# EAGLE design untitled (EAGLE 7.2.0)
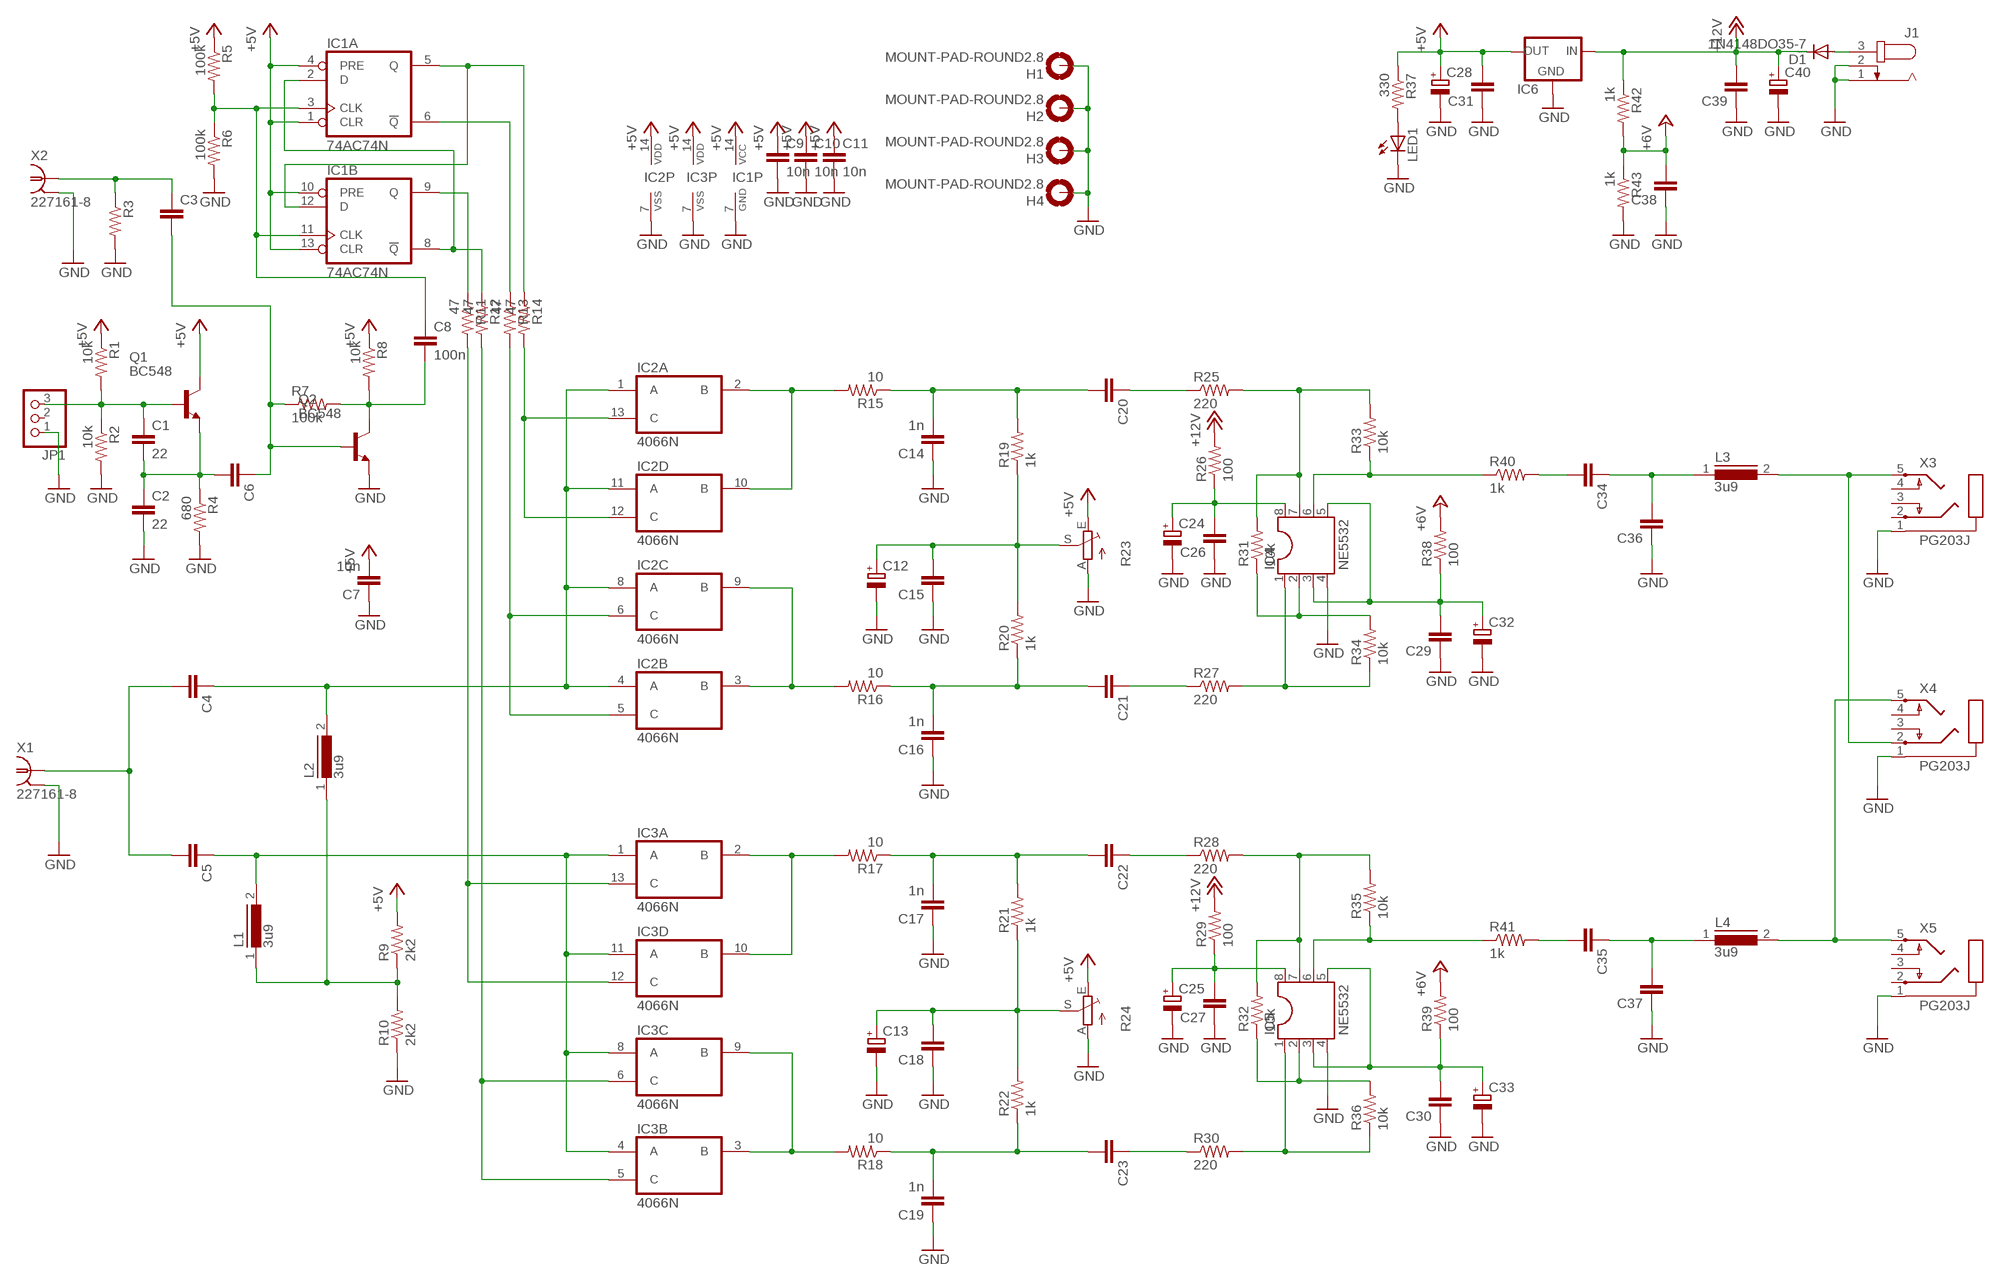
[diagram p0: schematic, sheet 1]

## Parts
C1  22  C-EU025-025X050  [C025-025X050]
C2  22  C-EU025-025X050  [C025-025X050]
C3  C-EU050-025X075  [C050-025X075]
C4  C-EU050-025X075  [C050-025X075]
C5  C-EU050-025X075  [C050-025X075]
C6  C-EU050-025X075  [C050-025X075]
C7  10n  C-EU050-025X075  [C050-025X075]
C8  100n  C-EU075-032X103  [C075-032X103]
C9  10n  C-EU050-025X075  [C050-025X075]
C10  10n  C-EU050-025X075  [C050-025X075]
C11  10n  C-EU050-025X075  [C050-025X075]
C12  CPOL-EUE5-6  [E5-6]
C13  CPOL-EUE5-6  [E5-6]
C14  1n  C-EU050-025X075  [C050-025X075]
C15  C-EU050-025X075  [C050-025X075]
C16  1n  C-EU050-025X075  [C050-025X075]
C17  1n  C-EU050-025X075  [C050-025X075]
C18  C-EU050-025X075  [C050-025X075]
C19  1n  C-EU050-025X075  [C050-025X075]
C20  C-EU050-025X075  [C050-025X075]
C21  C-EU050-025X075  [C050-025X075]
C22  C-EU050-025X075  [C050-025X075]
C23  C-EU050-025X075  [C050-025X075]
C24  CPOL-EUE5-6  [E5-6]
C25  CPOL-EUE5-6  [E5-6]
C26  C-EU050-025X075  [C050-025X075]
C27  C-EU050-025X075  [C050-025X075]
C28  CPOL-EUE5-6  [E5-6]
C29  C-EU050-025X075  [C050-025X075]
C30  C-EU050-025X075  [C050-025X075]
C31  C-EU050-025X075  [C050-025X075]
C32  CPOL-EUE5-6  [E5-6]
C33  CPOL-EUE5-6  [E5-6]
C34  C-EU050-025X075  [C050-025X075]
C35  C-EU050-025X075  [C050-025X075]
C36  C-EU050-025X075  [C050-025X075]
C37  C-EU050-025X075  [C050-025X075]
C38  C-EU050-025X075  [C050-025X075]
C39  C-EU050-025X075  [C050-025X075]
C40  CPOL-EUE5-6  [E5-6]
D1  1N4148DO35-7  [DO35-7]
H1  MOUNT-PAD-ROUND2.8  [2,8-PAD]
H2  MOUNT-PAD-ROUND2.8  [2,8-PAD]
H3  MOUNT-PAD-ROUND2.8  [2,8-PAD]
H4  MOUNT-PAD-ROUND2.8  [2,8-PAD]
IC1  74AC74N  [DIL14]
IC2  4066N  [DIL14]
IC3  4066N  [DIL14]
IC4  NE5532  DIL8  [DIL08]
IC5  NE5532  DIL8  [DIL08]
IC6  78XXS  [78XXS]
J1  JACK-PLUG0  [SPC4077]
JP1  PINHD-1X3  [1X03]
L1  3u9  MMICC7  [MMICC7]
L2  3u9  MMICC7  [MMICC7]
L3  3u9  MMICC7  [MMICC7]
L4  3u9  MMICC7  [MMICC7]
LED1  LED3MM  [LED3MM]
Q1  BC548  [TO92-EBC]
Q2  BC548  [TO92-EBC]
R1  10k  R-US_0207/7  [0207/7]
R2  10k  R-US_0207/7  [0207/7]
R3  R-US_0207/7  [0207/7]
R4  680  R-US_0207/7  [0207/7]
R5  100k  R-US_0207/7  [0207/7]
R6  100k  R-US_0207/7  [0207/7]
R7  100k  R-US_0207/7  [0207/7]
R8  10k  R-US_0207/7  [0207/7]
R9  2k2  R-US_0207/7  [0207/7]
R10  2k2  R-US_0207/7  [0207/7]
R11  47  R-US_0207/7  [0207/7]
R12  47  R-US_0207/7  [0207/7]
R13  47  R-US_0207/7  [0207/7]
R14  47  R-US_0207/7  [0207/7]
R15  10  R-US_0207/7  [0207/7]
R16  10  R-US_0207/7  [0207/7]
R17  10  R-US_0207/7  [0207/7]
R18  10  R-US_0207/7  [0207/7]
R19  1k  R-US_0207/7  [0207/7]
R20  1k  R-US_0207/7  [0207/7]
R21  1k  R-US_0207/7  [0207/7]
R22  1k  R-US_0207/7  [0207/7]
R23  TRIM_EU-B64Y  [B64Y]
R24  TRIM_EU-B64Y  [B64Y]
R25  220  R-US_0207/7  [0207/7]
R26  100  R-US_0207/7  [0207/7]
R27  220  R-US_0207/7  [0207/7]
R28  220  R-US_0207/7  [0207/7]
R29  100  R-US_0207/7  [0207/7]
R30  220  R-US_0207/7  [0207/7]
R31  10k  R-US_0207/7  [0207/7]
R32  10k  R-US_0207/7  [0207/7]
R33  10k  R-US_0207/7  [0207/7]
R34  10k  R-US_0207/7  [0207/7]
R35  10k  R-US_0207/7  [0207/7]
R36  10k  R-US_0207/7  [0207/7]
R37  330  R-US_0207/7  [0207/7]
R38  100  R-US_0207/7  [0207/7]
R39  100  R-US_0207/7  [0207/7]
R40  1k  R-US_0207/7  [0207/7]
R41  1k  R-US_0207/7  [0207/7]
R42  1k  R-US_0207/7  [0207/7]
R43  1k  R-US_0207/7  [0207/7]
X1  227161-8  [AMP_227161]
X2  227161-8  [AMP_227161]
X3  PG203J  [PG203J]
X4  PG203J  [PG203J]
X5  PG203J  [PG203J]

## Nets
+5V: C7.2 C9.1 C10.1 C11.1 C28.+ C31.2 IC1.1(A:CLR) IC1.4(A:PRE) IC1.10(B:PRE) IC1.13(B:CLR) IC1.14(P:VCC) IC2.14(P:VDD) IC3.14(P:VDD) IC6.OUT Q1.C R1.1 R5.1 R8.1 R9.2 R23.E R24.E R37.1
+12V: C39.2 C40.+ D1.C IC6.IN R26.2 R29.2 R42.1
+24V: C38.2 R38.2 R39.2 R42.2 R43.1 ; supply symbol labelled +6V
GND: C2.2 C7.1 C9.2 C10.2 C11.2 C12.- C13.- C14.1 C15.1 C16.1 C17.1 C18.1 C19.1 C24.- C25.- C26.1 C27.1 C28.- C29.1 C30.1 C31.1 C32.- C33.- C36.1 C37.1 C38.1 C39.1 C40.- H1.B2,8(MOUNT) H2.B2,8(MOUNT) H3.B2,8(MOUNT) H4.B2,8(MOUNT) IC1.7(P:GND) IC2.7(P:VSS) IC3.7(P:VSS) IC4.4 IC5.4 IC6.GND J1.1 J1.2 JP1.1 LED1.K(C) Q2.E R2.2 R3.2 R4.2 R6.2 R10.1 R23.A R24.A R43.2 X1.2 X2.2 X3.1 X4.1 X5.1
N$1: L1.1 L2.1 R9.1 R10.2
N$2: C4.2 C5.2 X1.1
N$3: C4.1 IC2.1(A:A) IC2.4(B:A) IC2.8(C:A) IC2.11(D:A) L2.2
N$4: C5.1 IC3.1(A:A) IC3.4(B:A) IC3.8(C:A) IC3.11(D:A) L1.2
N$5: IC2.3(B:B) IC2.9(C:B) R16.2
N$6: IC2.2(A:B) IC2.10(D:B) R15.2
N$7: IC3.2(A:B) IC3.10(D:B) R17.2
N$8: IC3.3(B:B) IC3.9(C:B) R18.2
N$9: IC2.12(D:C) IC2.13(A:C) R14.2
N$10: IC2.5(B:C) IC2.6(C:C) R13.2
N$11: IC3.12(D:C) IC3.13(A:C) R11.2
N$12: IC3.5(B:C) IC3.6(C:C) R12.2
N$13: C14.2 C20.2 R15.1 R19.2
N$14: C16.2 C21.2 R16.1 R20.1
N$15: C17.2 C22.2 R17.1 R21.2
N$16: C19.2 C23.2 R18.1 R22.1
N$17: IC1.2(A:D) IC1.8(B:!Q) R12.1
N$18: IC1.6(A:!Q) R13.1
N$19: IC1.5(A:Q) IC1.12(B:D) R14.1
N$20: IC1.9(B:Q) R11.1
N$21: C8.1 IC1.3(A:CLK) IC1.11(B:CLK) R5.2 R6.1
N$22: IC4.1 R27.2 R34.1
N$23: C21.1 R27.1
N$24: C20.1 R25.1
N$25: IC4.7 R25.2 R31.2 R33.2
N$26: IC4.2 R31.1 R34.2
N$27: IC4.6 R33.1 R40.1
N$28: C24.+ C26.2 IC4.8 R26.1
N$29: C29.2 C32.+ IC4.3 IC4.5 R38.1
N$30: C34.2 R40.2
N$31: C34.1 C36.2 L3.1
N$32: C12.+ C15.2 R19.1 R20.2 R23.S
N$35: D1.A J1.3
N$36: C3.1 R3.1 X2.1
N$37: IC5.1 R30.2 R36.1
N$38: C23.1 R30.1
N$39: C22.1 R28.1
N$40: IC5.7 R28.2 R32.2 R35.2
N$41: IC5.2 R32.1 R36.2
N$42: IC5.6 R35.1 R41.1
N$43: C25.+ C27.2 IC5.8 R29.1
N$44: C35.2 R41.2
N$45: C30.2 C33.+ IC5.3 IC5.5 R39.1
N$46: C35.1 C37.2 L4.1
N$47: C13.+ C18.2 R21.1 R22.2 R24.S
N$54: C1.1 JP1.3 Q1.B R1.2 R2.1
N$55: C1.2 C2.1 C6.2 Q1.E R4.1
N$56: L3.2 X3.5 X4.2
N$57: C8.2 Q2.C R7.2 R8.2
N$58: C3.2 C6.1 Q2.B R7.1
N$59: LED1.A R37.2
N$60: L4.2 X4.5 X5.5
Unconnected: JP1.2 X3.2 X3.3 X3.4 X4.3 X4.4 X5.2 X5.3 X5.4

## Library data of the parts
C1-C11 C14-C23 C26 C27 C29-C31 C34-C39 = rcl:C-EU: CAPACITOR, European symbol
C12 C13 C24 C25 C28 C32 C33 C40 = rcl:CPOL-EU: POLARIZED CAPACITOR, European symbol
D1 = diode:1N4148: DIODE high speed (Philips)
H1-H4 = holes:MOUNT-PAD-ROUND: MOUNTING PAD, round
IC1 = 74xx-eu:74*74: Dual D type positive edge triggered FLIP FLOP, preset and clear
IC2 IC3 = 40xx:4066: Quad bilateral ANALOG SWITCH
IC4 IC5 = ic-package:DIL8: Dual In Line / Socket
IC6 = v-reg:78XXS: VOLTAGE REGULATOR
J1 = con-jack:JACK-PLUG: DC POWER JACK Power Jack, DC, Right Angle, Through Hole, Rated 5A at 16VDC, PC Terminals Distributor: Farnell (www.Farnell.de) Drawing: 84N1161.pdf / 84N1162.pdf Manufacturer: SPC Technology (www.spctechnology.com) Type: SPC4077 / SPC 4078; OC_FARNELL: unknown; OC_NEWARK: unknown
JP1 = pinhead:PINHD-1X3: PIN HEADER
L1-L4 = inductors:MMICC7: INDUCTOR
LED1 = led:LED: LED OSRAM: - CHIPLED LG R971, LG N971, LY N971, LG Q971, LY Q971, LO R971, LY R971 LH N974, LH R974 LS Q976, LO Q976, LY Q976 LO Q996 - Hyper CHIPLED LW Q18S LB Q993, LB Q99A, LB R99A - SideLED LS A670, LO A670, LY A670, LG A670, LP A670 LB A673, LV A673, LT A673, LW A673 LH A674 LY A675 LS A676, LA A676, LO A676, LY A676, LW A676 LS A679, LY A679, LG A679 - Hyper Micro SIDELED® LS Y876, LA Y876, LO Y876, LY Y876 LT Y87S - SmartLED LW L88C, LW L88S LB L89C, LB L89S, LG L890 LS L89K, LO L89K, LY L89K LS L896, LA L896, LO L896, LY L896 - TOPLED LS T670, LO T670, LY T670, LG T670, LP T670 LSG T670, LSP T670, LSY T670, LOP T670, LYG T670 LG T671, LOG T671, LSG T671 LB T673, LV T673, LT T673, LW T673 LH T674 LS T676, LA T676, LO T676, LY T676, LB T676, LH T676, LSB T676, LW T676 LB T67C, LV T67C, LT T67C, LS T67K, LO T67K, LY T67K, LW E67C LS E67B, LA E67B, LO E67B, LY E67B, LB E67C, LV E67C, LT E67C LW T67C LS T679, LY T679, LG T679 LS T770, LO T770, LY T770, LG T770, LP T770 LB T773, LV T773, LT T773, LW T773 LH T774 LS E675, LA E675, LY E675, LS T675 LS T776, LA T776, LO T776, LY T776, LB T776 LHGB T686 LT T68C, LB T68C - Hyper Mini TOPLED® LB M676 - Mini TOPLED Santana® LG M470 LS M47K, LO M47K, LY M47K Source: http://www.osram.convergy.de LUXEON: - LUMILED® LXK2-PW12-R00, LXK2-PW12-S00, LXK2-PW14-U00, LXK2-PW14-V00 LXK2-PM12-R00, LXK2-PM12-S00, LXK2-PM14-U00 LXK2-PE12-Q00, LXK2-PE12-R00, LXK2-PE12-S00, LXK2-PE14-T00, LXK2-PE14-U00 LXK2-PB12-K00, LXK2-PB12-L00, LXK2-PB12-M00, LXK2-PB14-N00, LXK2-PB14-P00, LXK2-PB14-Q00 LXK2-PR12-L00, LXK2-PR12-M00, LXK2-PR14-Q00, LXK2-PR14-R00 LXK2-PD12-Q00, LXK2-PD12-R00, LXK2-PD12-S00 LXK2-PH12-R00, LXK2-PH12-S00 LXK2-PL12-P00, LXK2-PL12-Q00, LXK2-PL12-R00 Source: www.luxeon.com KINGBRIGHT: KA-3528ASYC Source: www.kingbright.com
Q1 Q2 = transistor-npn:BC548*: NPN Transistor
R1-R22 R25-R43 = rcl:R-US_: RESISTOR, American symbol
R23 R24 = pot:TRIM_EU-: POTENTIOMETER
X1 X2 = con-coax:?227161*: JACK, RIGHT ANGLE, 50 OHM, PCB, BNC Source: amp_227161.pdf; OC_FARNELL: unknown; OC_NEWARK: unknown
X3-X5 = con-hirschmann:PG203J: MIC/HEADPHONE JACK KS-S stereo microphone/headphone jack PG203JN (Schukat); OC_FARNELL: unknown; OC_NEWARK: unknown

## Board
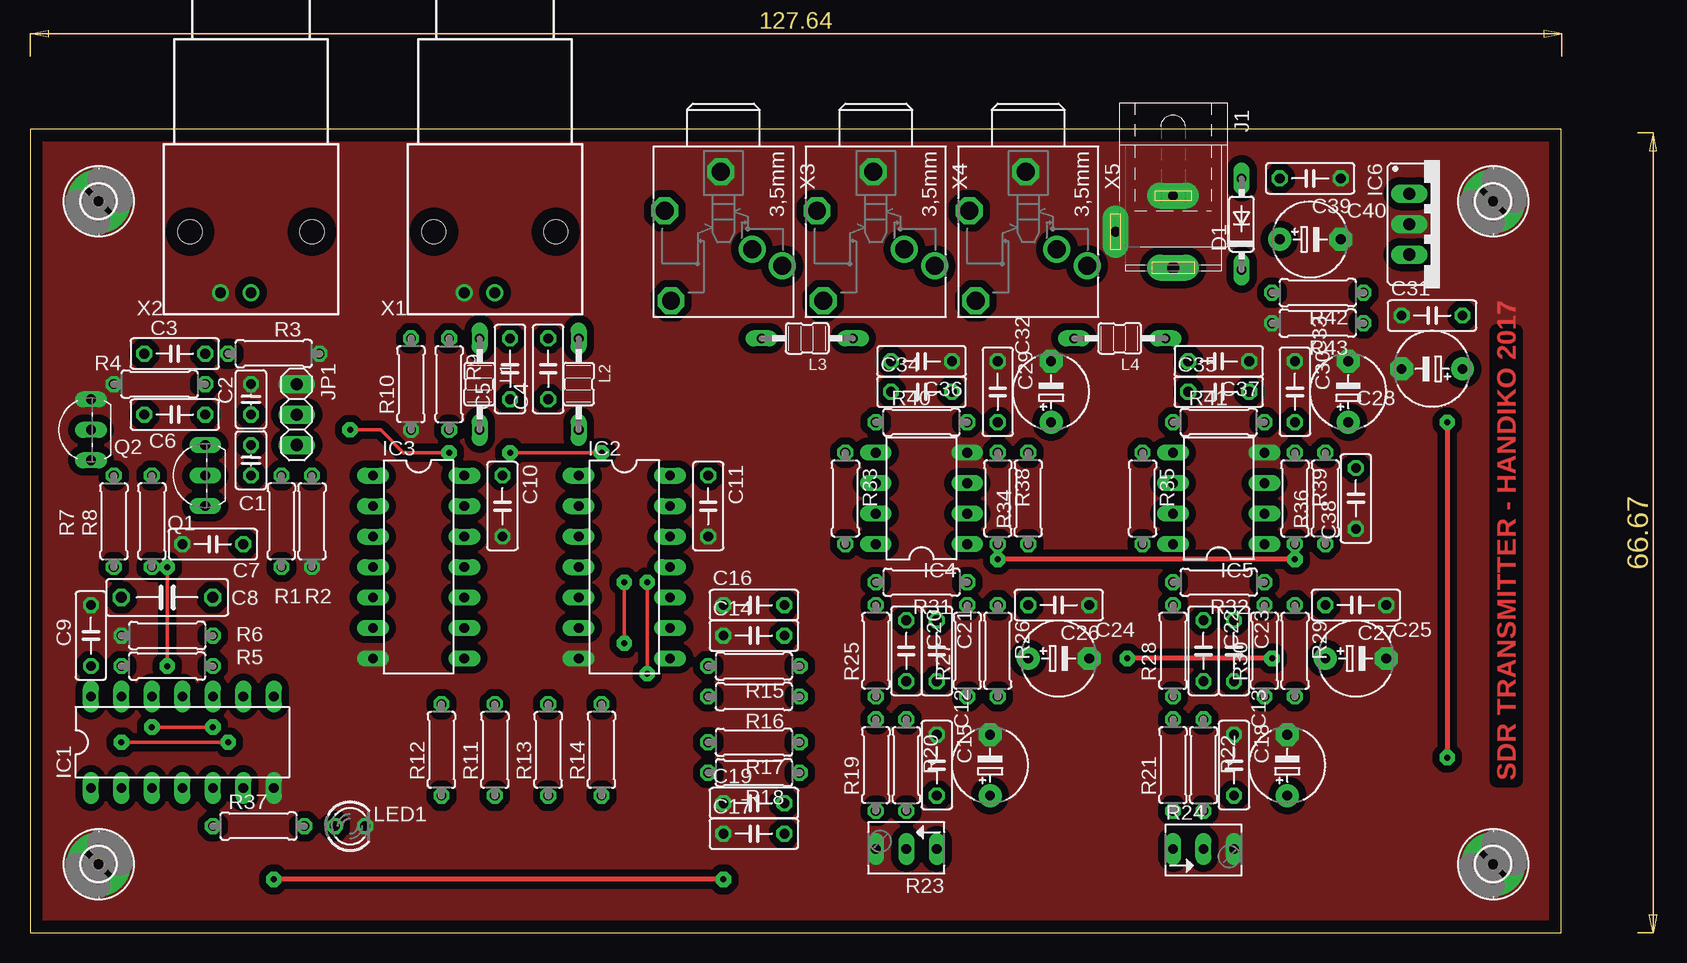
[diagram p1: board, top side]
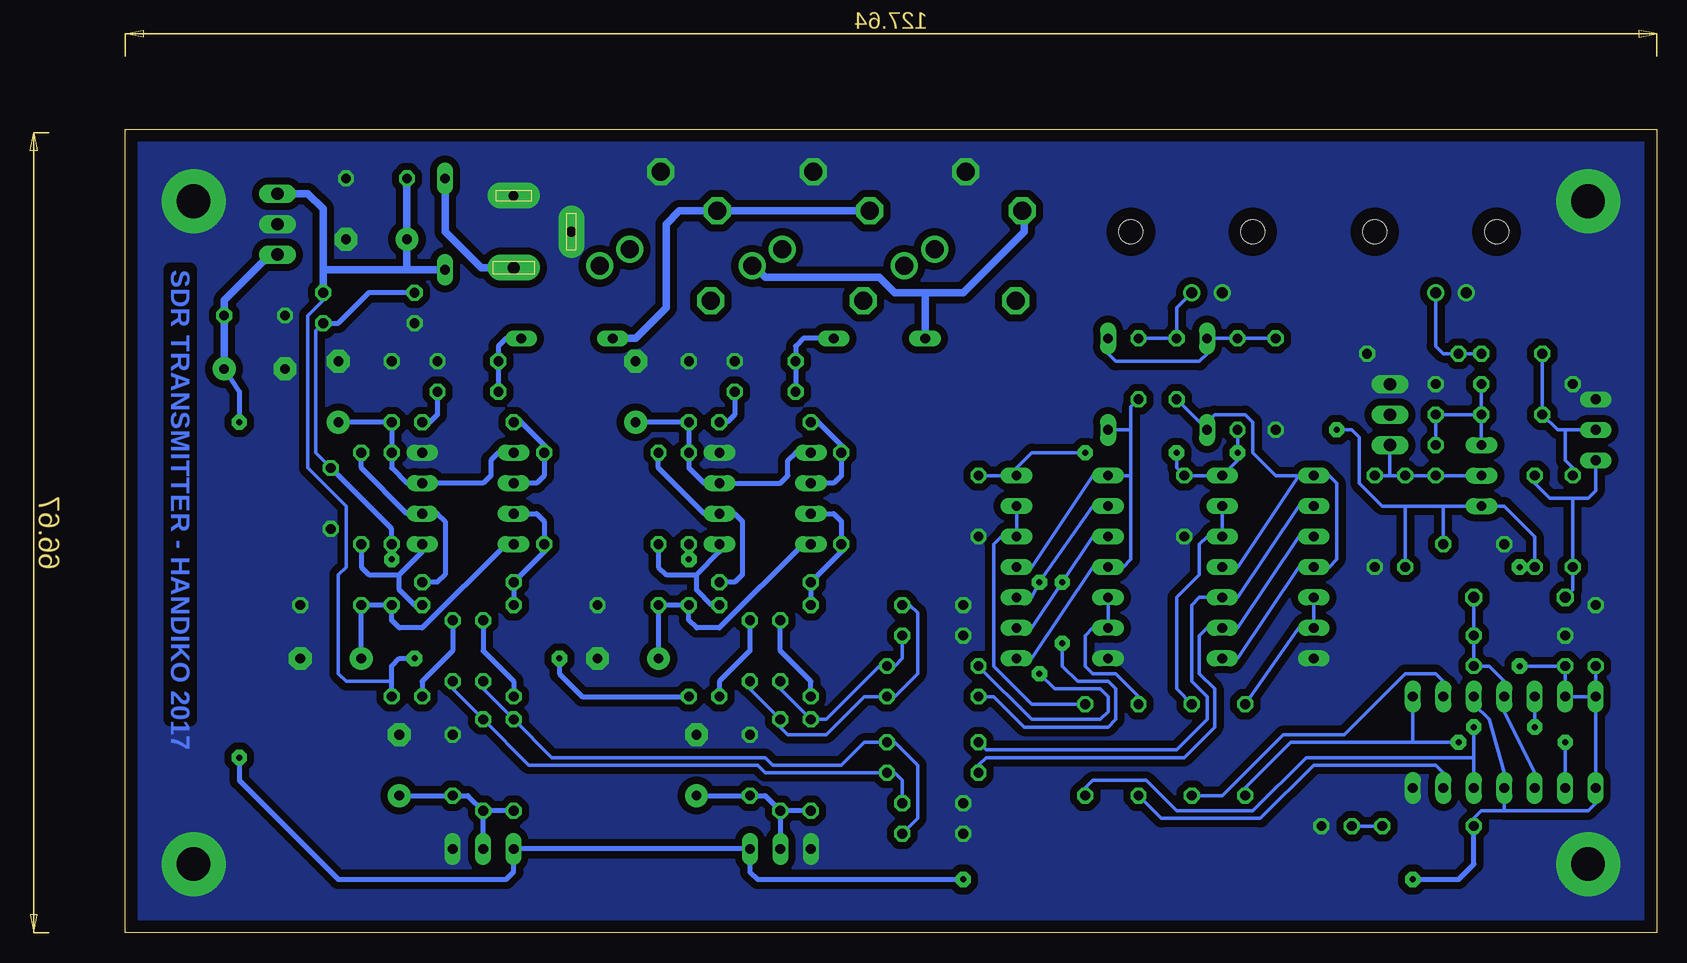
[diagram p2: board, bottom side, seen from below]

Size 127.61 x 66.98 mm. Coordinates in mm from the lower left corner, seen from the top.
Outline: 0,0 127.61,0 127.61,66.98 0,66.98 0,0
Copper layers (1*16): Top 0.035mm / dielectric 1.5mm / Bottom 0.035mm
Design rules "default": minimum track width 10mil, minimum drill 24mil, track to track 8mil, track to pad 8mil, pad to pad 8mil, via to via 8mil, smd to smd 8mil, copper to edge 40mil, drill to drill 8mil, minimum pad ring 10mil, minimum via ring 8mil, stop-mask expansion 4mil, vias tented up to drill 0mil, thermal gap 10mil

### Footprints (pad centres in the part's own frame; a part is rotated, then mirrored left to right if it is on the bottom)
C025-025X050 = drill 0.813 octagon: 1 -1.27,0; 2 1.27,0
C050-025X075 = drill 0.813 octagon: 1 -2.54,0; 2 2.54,0
C075-032X103 = drill 0.914 octagon: 1 -3.81,0; 2 3.81,0
E5-6 = drill 0.813 pad 1.905: + -2.54,0 | drill 0.813 pad 1.905 octagon: - 2.54,0
DO35-7 = drill 0.813 long: A 3.81,0; C -3.81,0
2,8-PAD = drill 2.8 pad 5.334: B2,8 0,0
DIL14 = drill 0.813 long: 1 -7.62,-3.81; 2 -5.08,-3.81; 3 -2.54,-3.81; 4 0,-3.81; 5 2.54,-3.81; 6 5.08,-3.81; 7 7.62,-3.81; 8 7.62,3.81; 9 5.08,3.81; 10 2.54,3.81; 11 0,3.81; 12 -2.54,3.81; 13 -5.08,3.81; 14 -7.62,3.81
DIL08 = drill 0.813 long: 1 -3.81,-3.81; 2 -1.27,-3.81; 3 1.27,-3.81; 4 3.81,-3.81; 5 3.81,3.81; 6 1.27,3.81; 7 -1.27,3.81; 8 -3.81,3.81
78XXS = drill 1.016 long: GND 0,-2.54; IN -2.54,-2.54; OUT 2.54,-2.54
SPC4077 = drill 0.8 pad 2.184 long: 1 -3,0; 2 0,-4.8 | drill 1 pad 2.184 long: 3 3,0
1X03 = drill 1.016 long: 1 -2.54,0; 2 0,0; 3 2.54,0
MMICC7 = drill 0.813 long: 1 -3.81,0; 2 3.81,0
LED3MM = drill 0.813 octagon: A -1.27,0; K 1.27,0
TO92-EBC = drill 0.813 long: B 0,-1.27; C -2.54,-1.27; E 2.54,-1.27
0207/7 = drill 0.813 octagon: 1 -3.81,0; 2 3.81,0
B64Y = drill 0.813 long: A 2.54,0; E -2.54,0; S 0,0
AMP_227161 = drill 0.9 pad 1.27: 1 0,-5.08; 2 -2.54,-5.08 | hole 2: -5.08,0; 5.08,0
PG203J = drill 1.499 octagon: 1 -5.004,-0.203; 4 5.74,-4.369; 5 -1.753,-4.902 | drill 1.499: 2 2.845,4.902; 3 1.448,2.388

### Placement (x,y rotation side)
C1  18.41,39.37 90 top
C2  18.41,44.45 90 top
C3  12.06,48.26 180 top
C4  43.18,46.99 90 top
C5  40.01,46.99 90 top
C6  12.06,43.18 0 top
C7  15.24,32.38 0 top
C8  11.43,27.94 180 top
C9  5.08,24.77 90 top
C10  39.37,35.56 270 top
C11  56.52,35.56 270 top
C12  80.01,13.97 90 top
C13  104.78,13.97 90 top
C14  60.33,24.77 0 top
C15  75.56,13.97 270 top
C16  60.33,27.3 0 top
C17  60.33,8.26 0 top
C18  100.33,13.97 270 top
C19  60.33,10.79 0 top
C20  73.03,23.5 270 top
C21  75.56,23.5 270 top
C22  97.79,23.5 270 top
C23  100.33,23.5 270 top
C24  85.72,22.86 0 top
C25  110.49,22.86 0 top
C26  85.72,27.3 180 top
C27  110.49,27.3 180 top
C28  116.84,46.99 180 top
C29  80.64,45.09 270 top
C30  105.41,45.09 270 top
C31  116.84,51.44 0 top
C32  85.09,45.09 90 top
C33  109.86,45.09 90 top
C34  74.3,45.09 0 top
C35  99.06,45.09 0 top
C36  74.3,47.62 180 top
C37  99.06,47.62 180 top
C38  110.49,36.2 90 top
C39  106.68,62.87 180 top
C40  106.68,57.78 0 top
D1  100.97,59.05 90 top
H1  5.71,60.96 0 top
H2  5.71,5.71 0 top
H3  121.92,5.71 0 top
H4  121.92,60.96 0 top
IC1  12.7,15.88 0 top
IC2  49.53,30.48 270 top
IC3  32.38,30.48 270 top
IC4  74.3,36.2 90 top
IC5  99.06,36.2 90 top
IC6  117.47,59.05 270 top
J1  95.25,58.42 270 top
JP1  22.23,43.18 270 top
L1  37.47,45.72 270 top
L2  45.72,45.72 270 top
L3  64.77,49.53 180 top
L4  90.81,49.53 180 top
LED1  26.67,8.89 0 top
Q1  13.34,38.1 90 top
Q2  3.81,41.91 90 top
R1  20.95,34.29 90 top
R2  23.5,34.29 270 top
R3  20.32,48.26 0 top
R4  10.79,45.72 180 top
R5  11.43,22.23 0 top
R6  11.43,24.77 180 top
R7  6.99,34.29 270 top
R8  10.16,34.29 90 top
R9  34.92,45.72 270 top
R10  31.75,45.72 90 top
R11  38.73,15.24 90 top
R12  34.29,15.24 90 top
R13  43.18,15.24 90 top
R14  47.62,15.24 90 top
R15  60.33,22.23 180 top
R16  60.33,19.68 180 top
R17  60.33,15.88 180 top
R18  60.33,13.34 180 top
R19  70.48,13.97 90 top
R20  73.03,13.97 270 top
R21  95.25,13.97 90 top
R22  97.79,13.97 270 top
R23  73.03,6.99 180 top
R24  97.79,6.99 0 top
R25  70.48,23.5 90 top
R26  80.64,23.5 270 top
R27  78.11,23.5 90 top
R28  95.25,23.5 90 top
R29  105.41,23.5 270 top
R30  102.87,23.5 90 top
R31  74.3,29.21 180 top
R32  99.06,29.21 180 top
R33  67.94,36.2 270 top
R34  83.19,36.2 90 top
R35  92.71,36.2 270 top
R36  107.95,36.2 90 top
R37  19.05,8.89 0 top
R38  80.64,36.2 270 top
R39  105.41,36.2 270 top
R40  74.3,42.55 0 top
R41  99.06,42.55 0 top
R42  107.31,53.34 180 top
R43  107.31,50.8 180 top
X1  38.73,58.42 0 top
X2  18.41,58.42 0 top
X3  57.78,58.42 270 top
X4  70.48,58.42 270 top
X5  83.19,58.42 270 top

### Tracks (layer width: path | path; a pad name or v marks a point on that pad's centre or on a via)
+5V  (via drill 0.5 pad 1.27)
  Top 0.305: v11.43,22.23 v11.43,30.48 | v47.62,40.01 v40.01,40.01 | v26.67,41.91 29.21,41.91 31.11,40.01 v34.92,40.01
  Top 0.406: v118.11,42.55 v118.11,14.61 | v57.78,4.45 v20.32,4.45
  Bottom 0.305: 17.78,35.56 Q1.C 12.7,35.56 10.16,33.02 R8.1 v11.43,30.48 | 17.78,35.56 20.95,35.56 | 20.95,35.56 R1.1 | C7.2 17.78,35.56 | C9.1 IC1.14 | IC1.14 IC1.13 R5.1 v11.43,22.23 | IC1.14 IC1.1 5.08,10.79 5.71,10.16 12.7,10.16 | IC1.10 15.24,19.05 13.97,17.78 12.7,13.34 IC1.4 12.7,10.16 | R9.2 v34.92,40.01 34.92,39.37 IC3.14 C10.1 40.01,38.73 v40.01,40.01 | C11.1 IC2.14 53.34,38.73 52.07,40.01 v47.62,40.01 | 20.95,35.56 22.86,35.56 24.77,37.47 24.77,41.27 25.4,41.91 v26.67,41.91 | 12.7,10.16 14.61,10.16 15.24,9.53 R37.1
  Bottom 0.406: C28.+ 118.11,45.09 v118.11,42.55 | v118.11,14.61 118.11,12.7 109.86,4.45 95.89,4.45 95.25,5.08 R24.E R23.E 75.56,5.08 74.93,4.45 v57.78,4.45 | v20.32,4.45 16.51,4.45 15.24,5.71 R37.1
  Bottom 0.61: IC6.OUT 115.57,56.52 119.38,52.7 C31.2 C28.+
+12V  (via drill 0.5 pad 1.27)
  Top 0.406: v103.5,22.86 v91.44,22.86
  Bottom 0.305: R42.1 111.12,52.7 112.39,51.44 112.39,38.73 109.22,35.56 109.22,30.48 109.86,29.84 109.86,21.59 109.22,20.95 105.41,20.95
  Bottom 0.406: R29.2 105.41,20.95 105.41,22.23 104.78,22.86 v103.5,22.86 | v91.44,22.86 91.44,21.59 89.53,19.68 R26.2
  Bottom 0.61: C39.2 C40.+ 104.14,55.24 | R42.1 111.12,55.24 | 111.12,55.24 111.12,60.33 112.39,61.59 IC6.IN | D1.C 104.14,55.24 | 104.14,55.24 111.12,55.24
+24V  (via drill 0.5 pad 1.27)
  Top 0.406: v105.41,31.11 v80.64,31.11
  Bottom 0.305: R43.1 111.76,50.16 111.76,40.01 C38.2
  Bottom 0.406: C38.2 105.41,33.66 R39.2 v105.41,31.11 | R42.2 107.31,53.34 109.86,50.8 R43.1 | v80.64,31.11 R38.2
GND
  pour Bottom (isolate 0.6, no thermals): 0,66.67 127.64,66.67 127.64,0 0,0
  pour Top (isolate 0.61, no thermals): 0,66.67 127.64,66.67 127.64,0 0,0
N$1
  Bottom 0.305: R10.2 R9.1 L1.1 37.47,48.26 38.1,47.62 45.09,47.62 45.72,48.26 L2.1
N$2
  Bottom 0.305: C4.2 C5.2 40.01,52.07 X1.1
N$3
  Bottom 0.305: C4.1 43.81,43.81 43.81,41.91 | 43.81,41.91 43.81,38.1 | 43.81,38.1 43.81,31.11 44.45,30.48 IC2.4 46.99,30.48 52.07,22.86 IC2.8 | L2.2 43.81,41.91 | 43.81,38.1 IC2.1 46.99,38.1 52.07,30.48 IC2.11
N$4
  Bottom 0.305: C5.1 L1.2 37.47,42.55 36.83,43.18 34.29,43.18 33.66,42.55 33.66,40.01 31.75,38.1 29.84,38.1 | 29.84,38.1 IC3.1 27.3,38.1 26.67,37.47 26.67,31.11 27.3,30.48 IC3.4 29.84,30.48 34.92,22.86 IC3.8 | IC3.11 34.92,30.48 29.84,38.1
N$5  (via drill 0.5 pad 1.27)
  Top 0.305: v49.53,24.13 v49.53,29.21
  Bottom 0.305: IC2.3 46.99,33.02 v49.53,29.21 52.07,25.4 IC2.9 | R16.2 55.24,19.68 52.7,17.14 45.72,17.14 45.09,17.78 45.09,20.32 45.72,20.95 48.26,20.95 49.53,22.23 v49.53,24.13
N$6  (via drill 0.5 pad 1.27)
  Top 0.305: v51.44,21.59 v51.44,29.21
  Bottom 0.305: IC2.2 46.99,35.56 v51.44,29.21 52.07,27.94 IC2.10 | R15.2 52.07,17.78 46.35,17.78 45.72,18.41 45.72,19.68 46.35,20.32 50.16,20.32 v51.44,21.59
N$7
  Bottom 0.305: IC3.2 29.84,35.56 34.92,27.94 IC3.10 38.1,27.94 38.73,27.3 38.73,20.95 37.47,19.68 37.47,17.78 40.01,15.24 55.88,15.24 R17.2
N$8
  Bottom 0.305: IC3.3 29.84,33.02 34.92,25.4 IC3.9 37.47,25.4 38.1,24.77 38.1,21.59 36.83,20.32 36.83,17.14 39.37,14.61 55.88,14.61 56.52,13.97 R18.2
N$9
  Bottom 0.305: IC2.13 IC2.12 54.61,33.02 55.24,32.38 55.24,22.23 52.07,19.05 R14.2
N$10
  Bottom 0.305: IC2.5 IC2.6 46.99,25.4 47.62,24.77 47.62,22.23 46.99,21.59 45.09,21.59 43.18,19.68 R13.2
N$11
  Bottom 0.305: IC3.13 IC3.12 37.47,33.02 38.1,32.38 38.1,29.84 40.01,27.94 40.01,20.32 R11.2
N$12
  Bottom 0.305: IC3.5 IC3.6 29.84,25.4 R12.2
N$13
  Bottom 0.305: C14.2 62.87,22.86 63.5,22.23 R15.1 64.77,22.23 69.22,17.78 R19.2 73.03,20.32 C20.2
N$14
  Bottom 0.305: C16.2 62.23,27.3 61.59,26.67 61.59,21.59 63.5,19.68 R16.1 66.04,19.68 69.22,16.51 72.39,16.51 73.03,17.14 R20.1 75.56,20.32 C21.2
N$15
  Bottom 0.305: C17.2 61.59,9.53 61.59,13.97 63.5,15.88 R17.1 66.04,15.88 67.94,13.97 73.66,13.97 74.3,14.61 92.08,14.61 R21.2 97.79,20.32 C22.2
N$16
  Bottom 0.305: C19.2 62.87,12.7 63.5,13.34 R18.1 74.3,13.34 74.93,13.97 93.98,13.97 R22.1 100.33,20.32 C23.2
N$17  (via drill 0.5 pad 1.27)
  Top 0.305: v7.62,15.88 v16.51,15.88
  Bottom 0.305: IC1.2 v7.62,15.88 | v16.51,15.88 20.32,15.88 | 20.32,15.88 IC1.8 | 20.32,15.88 30.48,15.88 34.29,12.06 R12.1
N$18
  Bottom 0.305: IC1.6 17.78,13.34 18.41,13.97 28.57,13.97 33.02,9.53 41.27,9.53 R13.1
N$19  (via drill 0.5 pad 1.27)
  Top 0.305: v10.16,17.14 v15.24,17.14
  Bottom 0.305: IC1.12 v10.16,17.14 | v15.24,17.14 15.24,14.61 | 15.24,14.61 IC1.5 | R14.1 47.62,12.06 46.99,12.7 42.55,12.7 40.01,10.16 33.66,10.16 29.21,14.61 15.24,14.61
N$20
  Bottom 0.305: IC1.9 17.78,20.95 18.41,21.59 20.95,21.59 26.04,16.51 31.11,16.51 36.2,11.43 R11.1
N$21
  Bottom 0.305: C8.1 R6.1 R5.2 13.97,22.23 12.7,20.95 IC1.11 12.7,18.41 10.16,13.34 IC1.3
N$22
  Bottom 0.406: R34.1 83.19,30.48 82.55,29.84 80.01,29.84 | 80.01,29.84 78.11,31.75 IC4.1 | R27.2 78.74,27.3 80.01,28.57 80.01,29.84
N$23
  Bottom 0.406: C21.1 75.56,23.5 78.11,20.95 R27.1
N$24
  Bottom 0.406: R25.1 70.48,20.95 73.03,23.5 C20.1
N$25
  Bottom 0.406: IC4.7 68.58,34.92 67.94,34.29 R33.2 67.94,31.75 R31.2 R25.2
N$26
  Bottom 0.406: R34.2 83.19,38.73 79.38,34.92 IC4.2 76.83,34.92 76.2,34.29 76.2,29.84 76.83,29.21 R31.1
N$27
  Bottom 0.406: R40.1 69.85,42.55 67.94,40.64 R33.1 67.94,38.1 68.58,37.47 IC4.6
N$28
  Bottom 0.406: IC4.8 71.12,32.38 78.11,25.4 80.01,25.4 80.64,26.04 R26.1 C26.2 C24.+
N$29
  Bottom 0.406: C32.+ C29.2 R38.1 80.64,38.73 79.38,37.47 IC4.3 73.03,37.47 72.39,38.1 72.39,39.37 71.75,40.01 IC4.5
N$30
  Bottom 0.406: C34.2 76.83,43.18 77.47,42.55 R40.2
N$31
  Bottom 0.406: L3.1 71.12,49.53 71.75,48.9 C36.2 C34.1
N$32
  Bottom 0.406: R19.1 R20.2 | R20.2 R23.S | C12.+ C15.2 74.3,11.43 R20.2
N$35
  Bottom 0.61: J1.3 97.97,55.42 100.97,58.42 D1.A
N$36
  Bottom 0.305: C3.1 R3.1 17.78,48.26 18.41,48.9 X2.1
N$37
  Bottom 0.406: R36.1 107.95,30.48 107.31,29.84 104.78,29.84 | 104.78,29.84 102.87,31.75 IC5.1 | R30.2 103.5,27.3 104.78,28.57 104.78,29.84
N$38
  Bottom 0.406: C23.1 100.33,23.5 102.87,20.95 R30.1
N$39
  Bottom 0.406: C22.1 97.79,23.5 95.25,20.95 R28.1
N$40
  Bottom 0.406: IC5.7 93.34,34.92 92.71,34.29 R35.2 92.71,31.75 R32.2 R28.2
N$41
  Bottom 0.406: R36.2 107.95,38.73 104.14,34.92 IC5.2 101.6,34.92 100.97,34.29 100.97,29.84 101.6,29.21 R32.1
N$42
  Bottom 0.406: R41.1 94.61,42.55 92.71,40.64 R35.1 92.71,38.1 93.34,37.47 IC5.6
N$43
  Bottom 0.406: IC5.8 95.89,32.38 102.87,25.4 104.78,25.4 105.41,26.04 R29.1 C27.2 C25.+
N$44
  Bottom 0.406: C35.2 101.6,43.18 102.23,42.55 R41.2
N$45
  Bottom 0.406: IC5.5 96.52,40.01 97.16,39.37 97.16,38.1 97.79,37.47 IC5.3 104.14,37.47 105.41,38.73 R39.1 C30.2 C33.+
N$46
  Bottom 0.406: L4.1 95.89,49.53 96.52,48.9 C37.2 C35.1
N$47
  Bottom 0.406: R21.1 R22.2 | R24.S R22.2 | C13.+ C18.2 99.06,11.43 R22.2
N$54
  Bottom 0.305: Q1.B C1.1 R1.2 22.23,38.1 | 22.23,38.1 R2.1 | JP1.3 22.23,38.1
N$55
  Bottom 0.305: Q1.E C6.2 | C6.2 R4.1 | C6.2 C2.1 C1.2
N$56
  Bottom 0.61: X4.2 75.26,55.58 74.3,54.61 64.77,54.61 63.5,53.34 60.96,53.34 | 60.96,53.34 57.78,53.34 52.7,58.42 52.7,59.99 X3.5 | L3.2 60.96,53.34
N$57
  Bottom 0.305: Q2.C 5.08,36.83 5.71,36.2 6.99,36.2 | 6.99,36.2 8.89,36.2 10.16,37.47 R8.2 | 6.99,36.2 R7.2 6.99,28.57 C8.2
N$58
  Bottom 0.305: C3.2 C6.1 8.26,41.91 7.62,41.91 | Q2.B 7.62,41.91 | R7.1 6.99,38.73 7.62,39.37 7.62,41.91
N$59
  Bottom 0.305: R37.2 LED1.A
N$60
  Bottom 0.61: X4.5 X5.5 81.43,60.17 82.55,59.05 82.55,52.07 85.09,49.53 L4.2

### Text on the board
Top: SDR TRANSMITTER - HANDIKO 2017
Bottom: SDR TRANSMITTER - HANDIKO 2017